# EAGLE design HFS_4011s_Rev_0 (EAGLE 8.3.2)
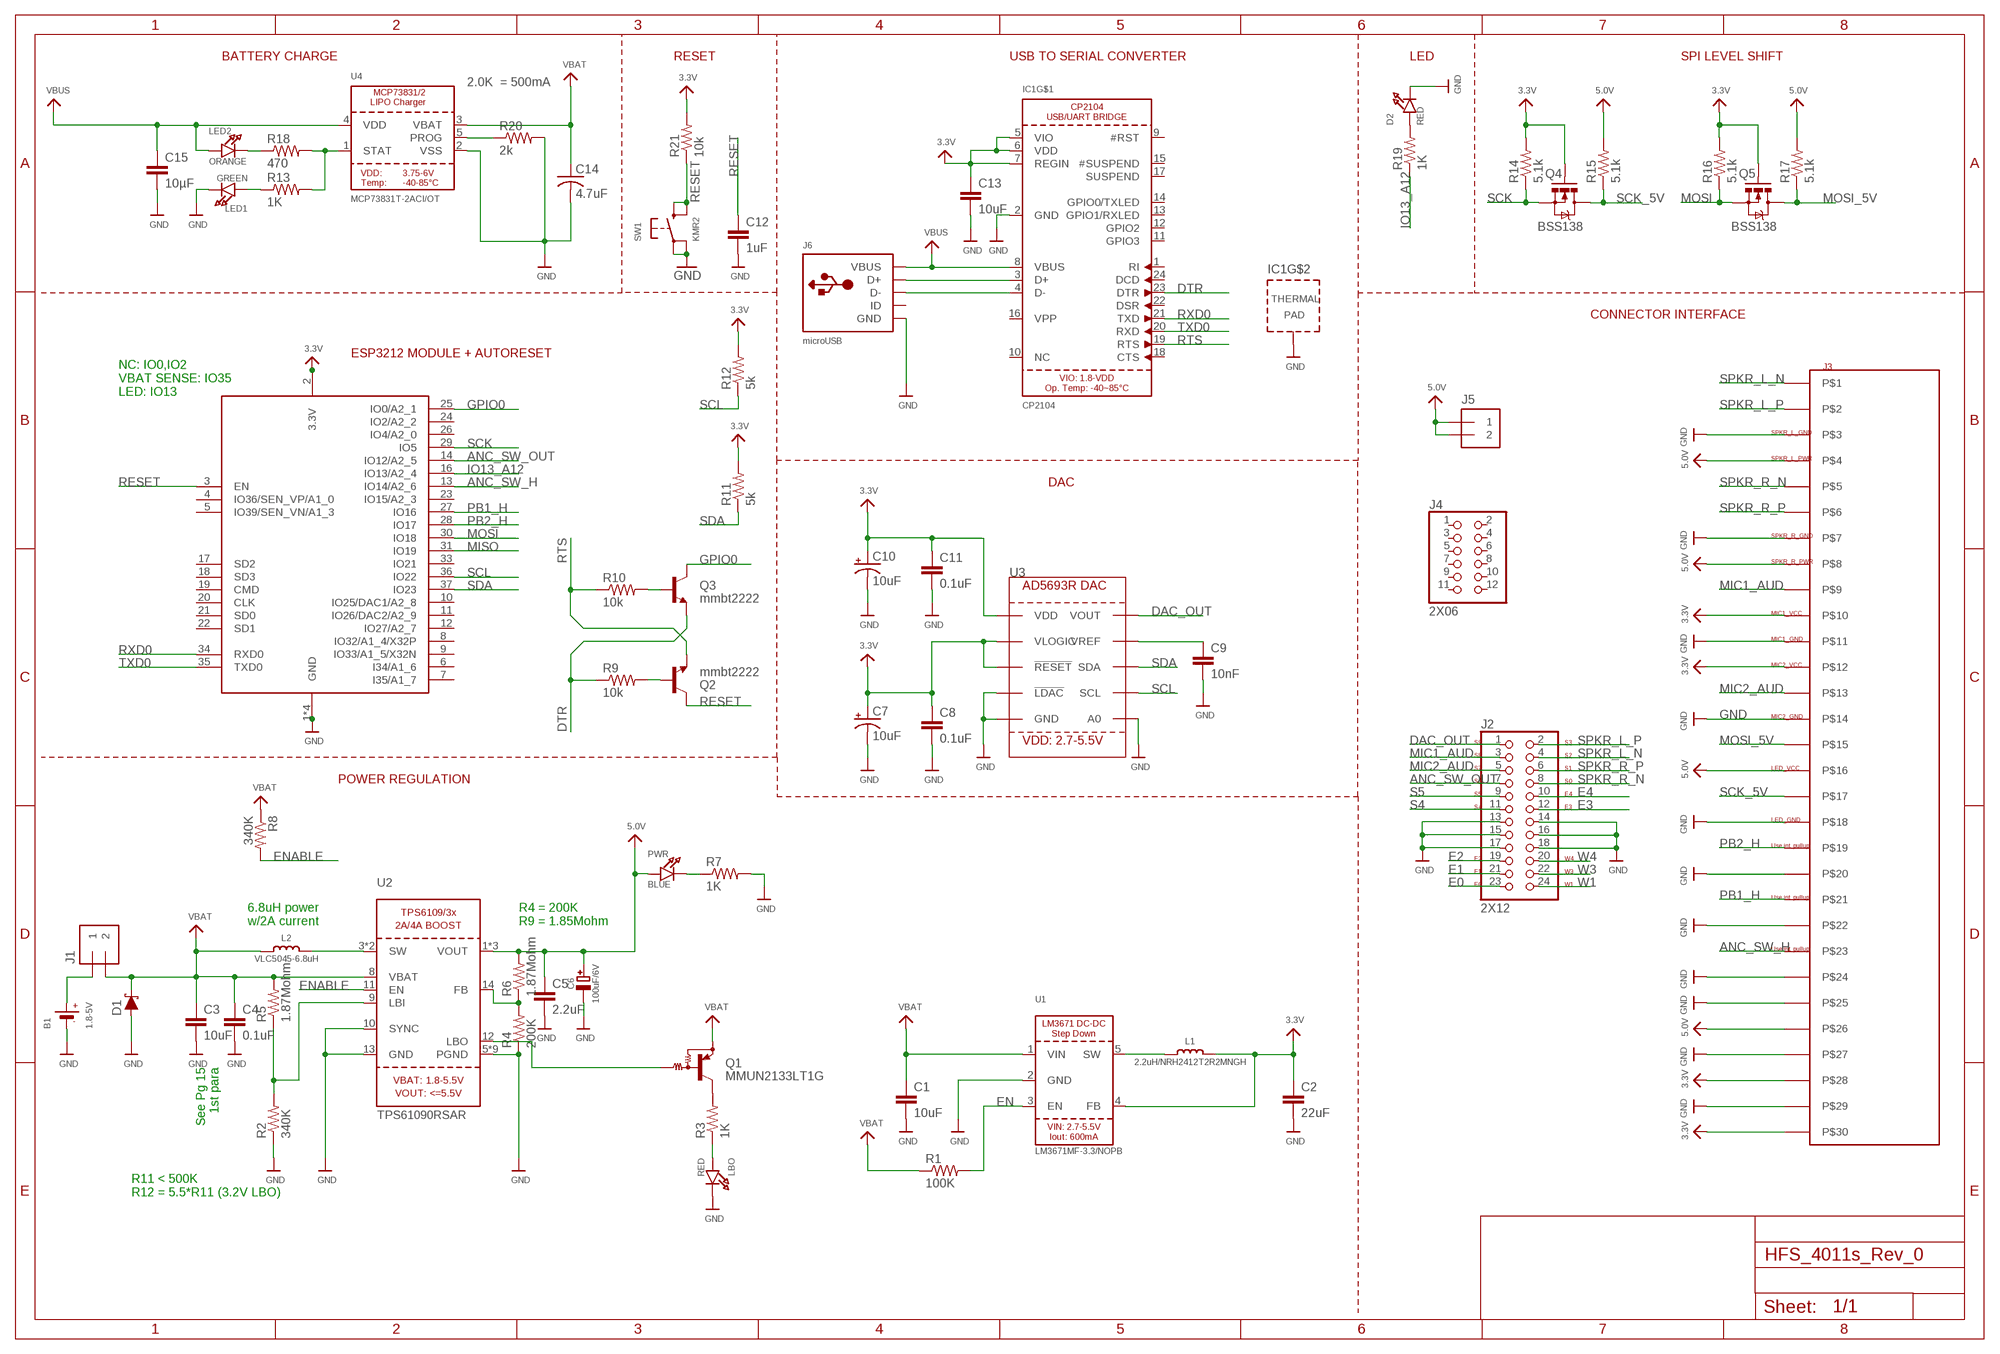
[diagram p0: schematic, sheet 1]

## Parts
B1  1.8-5V  BATTERY  [JSTPH2]
C1  10uF  C-EUC0603  [C0603]
C2  22uF  C-EUC0603  [C0603]
C3  10uF  C-EUC0603  [C0603]
C4  0.1uF  C-EUC0603  [C0603]
C5  2.2uF  C-EUC0603  [C0603]
C6  100uF/6V  CAP_TANTALUMB/3528_REFLOW  [EIA3528-21/B-R]
C7  10uF  10UF-TANT  [EIA3216]
C8  0.1uF  C-EUC0603  [C0603]
C9  10nF  C-EUC0603  [C0603]
C10  10uF  10UF-TANT  [EIA3216]
C11  0.1uF  C-EUC0603  [C0603]
C12  1uF  C-EUC0603  [C0603]
C13  10uF  C-EUC0603  [C0603]
C14  4.7uF  C-USC1206  [C1206]
C15  10µF  C-EUC0603  [C0603]
D1  SMAJ5.0CALFDKR-ND  [DO-214AC]
D2  RED  LED0805_NOOUTLINE  [CHIPLED_0805_NOOUTLINE]
IC1  CP2104  [QFN24_4MM_SMSC]
J1  1X02  [1X02]
J2  2X12  [2X12]
J3  MOLEX_IGRID_15X2CONNECTOR  [MOLEX_IGRID15X2CONNECTOR]
J4  2X06  [2X06]
J5  1X02  [1X02]
J6  microUSB  USBMICRO_20329  [4UCONN_20329]
L1  2.2uH/NRH2412T2R2MNGH  INDUCTORNRH2412T  [INDUCTOR_TAIYOYUDEN_NRH2412T]
L2  VLC5045-6.8uH  INDUCTORTDK_VLC5045  [INDUCTOR_5X5MM_TDK_VLC5045]
LBO  RED  LED0805_NOOUTLINE  [CHIPLED_0805_NOOUTLINE]
LED1  GREEN  LED0805_NOOUTLINE  [CHIPLED_0805_NOOUTLINE]
LED2  ORANGE  LED0805_NOOUTLINE  [CHIPLED_0805_NOOUTLINE]
PWR  BLUE  LED0805_NOOUTLINE  [CHIPLED_0805_NOOUTLINE]
Q1  MMUN2133LT1G  MUN2114T1-PNP_DRIVER-SC59-BEC  [SC59-BEC]
Q2  mmbt2222  TRANSISTOR_NPNSOT23-3  [SOT23-3]
Q3  mmbt2222  TRANSISTOR_NPNSOT23-3  [SOT23-3]
Q4  BSS138  MOSFET-NCHANNELSMD  [SOT23-3]
Q5  BSS138  MOSFET-NCHANNELSMD  [SOT23-3]
R1  100K  R-US_R0603  [R0603]
R2  340K  R-US_R0603  [R0603]
R3  1K  R-US_R0603  [R0603]
R4  200K  R-US_R0603  [R0603]
R5  1.87Mohm  R-US_R0603  [R0603]
R6  1.87Mohm  R-US_R0603  [R0603]
R7  1K  R-US_R0603  [R0603]
R8  340K  R-US_R0603  [R0603]
R9  10k  R-US_R0603  [R0603]
R10  10k  R-US_R0603  [R0603]
R11  5k  R-US_R0603  [R0603]
R12  5k  R-US_R0603  [R0603]
R13  1K  R-US_R0603  [R0603]
R14  5.1k  R-US_R0603  [R0603]
R15  5.1k  R-US_R0603  [R0603]
R16  5.1k  R-US_R0603  [R0603]
R17  5.1k  R-US_R0603  [R0603]
R18  470  R-US_R0603  [R0603]
R19  1K  R-US_R0603  [R0603]
R20  2k  R-US_R0603  [R0603]
R21  10k  R-US_R0603  [R0603]
SW1  KMR2  SWITCH_TACT_SMT4.6X2.8  [BTN_KMR2_4.6X2.8]
U1  LM3671MF-3.3/NOPB  VREG_LM3671  [SOT23-5]
U2  TPS61090RSAR  VREG_TPS6103X  [PVQFN-16]
U3  AD5693R  [MSOP10]
U4  MCP73831T-2ACI/OT  MCP73831/2  [SOT23-5]
X1  ESP32_WROOM32_SKINNY  [WROOM32_SKINNY]

## Nets
3.3V: C2.1 C7.A(+) C8.1 C10.A(+) C11.1 C13.1 IC1.5(VIO) IC1.6(VDD) IC1.7(REGIN) J3.P$10 J3.P$12 J3.P$28 J3.P$30 L1.2 Q4.1(G) Q5.1(G) R11.2 R12.2 R14.2 R16.2 R21.2 U1.4(FB) U3.1(VDD) U3.2(VLOGIC) U3.3(!RESET!) X1.2(3.3V)
5.0V: C5.1 C6.+ J3.P$4 J3.P$8 J3.P$16 J3.P$26 J5.1 J5.2 PWR.A R6.2 R15.2 R17.2 U2.1(VOUT) U2.15(VOUT) U2.16(VOUT)
ANC_SW_H: J3.P$23 X1.13(IO14/A2_6)
ANC_SW_OUT: J2.7 X1.14(IO12/A2_5)
DAC_OUT: J2.1 U3.10(VOUT)
DTR: IC1.23(DTR) Q3.2(E) R9.1
E0: J2.23
E1: J2.21
E2: J2.19
E3: J2.12
E4: J2.10
EN: R1.2 U1.3(EN)
ENABLE: R8.2 U2.11(EN)
GND: B1.1(-) C1.2 C2.2 C3.2 C4.2 C5.2 C6.- C7.C(-) C8.2 C9.2 C10.C(-) C11.2 C12.2 C13.2 C14.2 C15.2 D1.A D2.C IC1.2(GND) IC1.THERM(TP) J2.13 J2.14 J2.15 J2.16 J2.17 J2.18 J3.P$3 J3.P$7 J3.P$11 J3.P$14 J3.P$18 J3.P$20 J3.P$22 J3.P$24 J3.P$25 J3.P$27 J3.P$29 J6.BASE@1(GND) J6.BASE@2(GND) J6.GND J6.SPRT@1(GND) J6.SPRT@2(GND) J6.SPRT@3(GND) J6.SPRT@4(GND) LBO.C LED1.C R2.1 R4.1 R7.2 R20.2 SW1.A'(P1) SW1.A(P) U1.2(GND) U2.5(PGND) U2.6(PGND) U2.7(PGND) U2.10(SYNC) U2.13(GND) U2.P$18(PGND) U2.P$19(PGND) U2.P$20(PGND) U2.P$21(PGND) U2.P$22(PGND) U2.THERMAL(PGND) U3.4(!LDAC!) U3.5(GND) U3.6(A0) U4.2(VSS) X1.1(GND) X1.15(GND) X1.38(GND) X1.P$1(GND)
GPIO0: Q3.3(C) X1.25(IO0/A2_1)
IO13_A12: R19.1 X1.16(IO13/A2_4)
LBO: Q1.B U2.12(LBO)
MIC1_AUD: J2.3 J3.P$9
MIC2_AUD: J2.5 J3.P$13
MISO: X1.31(IO19)
MOSI: Q5.2(S) R16.1 X1.30(IO18)
MOSI_5V: J3.P$15 Q5.3(D) R17.1
N$1: LED2.C R18.1
N$2: IC1.3(D+) J6.D+
N$3: L2.P$2 U2.3(SW) U2.4(SW)
N$4: R2.2 R5.1 U2.9(LBI)
N$5: D2.A R19.2
N$6: IC1.4(D-) J6.D-
N$7: R13.2 R18.2 U4.1(STAT)
N$8: R20.1 U4.5(PROG)
N$9: LED1.A R13.1
N$10: PWR.C R7.1
N$11: R4.2 R6.1 U2.14(FB)
N$12: Q2.1(B) R9.2
N$13: Q3.1(B) R10.2
N$14: LBO.A R3.1
N$15: Q1.C R3.2
N$16 [power]: B1.2(+) J1.1
N$17: L1.1 U1.5(SW)
N$20: C9.1 U3.9(VREF)
PB1_H: J3.P$21 X1.27(IO16)
PB2_H: J3.P$19 X1.28(IO17)
RESET: C12.1 Q2.3(C) R21.1 SW1.B'(S1) SW1.B(S) X1.3(EN)
RTS: IC1.19(RTS) Q2.2(E) R10.1
RXD0: IC1.21(TXD) X1.34(RXD0)
S4: J2.11
S5: J2.9
SCK: Q4.2(S) R14.1 X1.29(IO5)
SCK_5V: J3.P$17 Q4.3(D) R15.1
SCL: R12.1 U3.7(SCL) X1.36(IO22)
SDA: R11.1 U3.8(SDA) X1.37(IO23)
SPKR_L_N: J2.4 J3.P$1
SPKR_L_P: J2.2 J3.P$2
SPKR_R_N: J2.8 J3.P$5
SPKR_R_P: J2.6 J3.P$6
TXD0: IC1.20(RXD) X1.35(TXD0)
VBAT: C1.1 C3.1 C4.1 C14.1 D1.C J1.2 L2.P$1 Q1.E R1.1 R5.2 R8.1 U1.1(VIN) U2.8(VBAT) U4.3(VBAT)
VBUS: C15.1 IC1.8(VBUS) J6.VBUS LED2.A U4.4(VDD)
W1: J2.24
W3: J2.22
W4: J2.20
Unconnected: IC1.1(RI) IC1.9(#RST) IC1.10(NC) IC1.11(GPIO3) IC1.12(GPIO2) IC1.13(GPIO1/RXLED) IC1.14(GPIO0/TXLED) IC1.15(#SUSPEND) IC1.16(VPP) IC1.17(SUSPEND) IC1.18(CTS) IC1.22(DSR) IC1.24(DCD) J4.1 J4.2 J4.3 J4.4 J4.5 J4.6 J4.7 J4.8 J4.9 J4.10 J4.11 J4.12 J6.ID X1.4(IO36/SEN_VP/A1_0) X1.5(IO39/SEN_VN/A1_3) X1.6(I34/A1_6) X1.7(I35/A1_7) X1.8(IO32/A1_4/X32P) X1.9(IO33/A1_5/X32N) X1.10(IO25/DAC1/A2_8) X1.11(IO26/DAC2/A2_9) X1.12(IO27/A2_7) X1.17(SD2) X1.18(SD3) X1.19(CMD) X1.20(CLK) X1.21(SD0) X1.22(SD1) X1.23(IO15/A2_3) X1.24(IO2/A2_2) X1.26(IO4/A2_0) X1.33(IO21)

## Notes on the sheet
- BATTERY CHARGE | RESET | USB TO SERIAL CONVERTER | LED | SPI LEVEL SHIFT
- 2.0K  = 500mA
- CONNECTOR INTERFACE
- ESP3212 MODULE + AUTORESET
- NC: IO0,IO2
  VBAT SENSE: IO35
  LED: IO13
- SPKR_L_GND
- SPKR_L_PWR
- DAC
- SPKR_R_GND
- SPKR_R_PWR
- MIC1_VCC
- MIC1_GND
- MIC2_VCC
- MIC2_GND
- S9 | S3
- S8 | S2
- S7 | S1 | LED_VCC
- POWER REGULATION | S6 | S0
- S5 | E4
- S4 | E3
- LED_GND
- Use int. pullup
- E2 | W4
- E1 | W3
- E0 | W1
- Use int. pullup
- 6.8uH power
  w/2A current
- R4 = 200K
  R9 = 1.85Mohm
- Use int. pullup
- See Pg 15
  1st para
- R11 < 500K
  R12 = 5.5*R11 (3.2V LBO)

## Library data of the parts
B1 = microbuilder:BATTERY: CR1220 SMT - Digikey: 3001K-ND CD2032 BAT-HLD-001 - Digikey: BAT-HLD-001-ND
C1-C5 C8 C9 C11-C13 C15 = rcl:C-EU: CAPACITOR, European symbol
C6 = microbuilder:CAP_TANTALUM: Tantalum Capacitors Wave footprints have larger pads and are meant to be used for hand soldering. Reflow footprints are optimised for solder paste and a reflow oven. EIA3216-18/A-[R/W] - Size A / 3216-18 / 1206 footprint 4.7µF 25V 10% Tantalum Capacitor 10µF 16V 10% Tantalum Capacitor [Digikey: 495-2236-2-ND] EIA3528-21/B-[R/W] - Size B / 3528-21 47µF 10V 10% Tantalum Capactior [Digikey: 495-2216-1-ND] EIA6032-28/C-[R/W] - Size C / 6032-28 10µF 35V 20% Tantalum Capacitor [Digikey: 495-2285-1-ND] 100µF 16V 10% Tantalum Capactior [Digikey: 399-5214-1-ND]
C7 C10 = SparkFun-Retired:10UF-TANT: 10uF Tantalum SMT CAP-00811- 16V 10% (EIA-3216); PROD_ID: CAP-00811
C14 = rcl:C-US: CAPACITOR, American symbol
D1 = HFS4011sCustom:SMAJ5.0CALFDKR-ND
D2 LBO LED1 LED2 PWR = microbuilder:LED: LED 0603 - 0603 Surface Mount Package 2mA: Green LED - Low Power (3.9mcd, 2ma, 1.7Vf) - Digikey: 475-2709-2-ND Orange LED - Low Power (9.8mcd, 2ma, 1.8Vf) - Digikey: 475-1194-2-ND Red LED - Low Power (5mcd, 2ma, 1.8Vf) - Digikey: 475-1195-2-ND Yellow LED - Low Power (7mcd, 2ma, 1.8Vf) - Digikey: 475-1196-2-ND 5mA: Blue LED - Low Power (17mcd, 5ma, 2.9Vf) - Digikey: LNJ937W8CRACT-ND 0805 - 0805 Surface Mount Package 2mA: Red LED (8.8mcd, 2mA, 1.8Vf, Clear) - Low Power [Digikey: 475-2510-1-ND] Green LED (5mcd, 2mA, 1.8Vf, Clear) - Low Power [Digikey: 475-2730-1-ND] Yellow LED (11.3mcd, 2mA, 1.8Vf, Clear) - Low Power [Digikey: 475-2555-1-ND] 20mA: Red LED (104mcd, 20mA, Diffused) - LS R976 [Digikey: 475-1278-6-ND] Red LED (12mcd, 20mA, 2.0Vf, Clear) - APT2012EC [Digikey: 754-1128-1-ND] Green LED (15mcd, 20mA, 2.2Vf, Clear) - APT2012GC [Digikey: 754-1131-1-ND] Orange LED (160mcd, 20mA, 2.1Vf, Clear) - APT2012SECK [Digikey: 754-1130-1-ND] 1206 - 1206 Surface Mount Package Green LED (26mcd, 20mA, Diffused) - LG N971 [Digikey: 475-1407-6-ND] Red LED (15mcd, 20mA, Diffused) - LH N974 [Digikey: 475-1416-6-ND] Cree - Cree High-Power Surface Mount LEDs XPEBWT-L1-0000-00D50 - White 111lm 350mA 2.9Vf 6200K 110° XTEAWT-00-0000-00000LEE3 - White 114lm 350mA 2.85Vf 5000K 115° Everlight - Everlight 45-21 Series Surface Mount LEDs 45-21/QK2C-B2832AC2CB2/2T - Warm White 2000mcd 20mA 3.25Vf 3050K 120° 45-21/LK2C-B38452C4CB2/2T - Nuetral White 2000mcd 20mA 3.25Vf 4150K 120° 45-21/LK2C-B50634C6CB2/2T - Cold White 2200mcd 20mA 3.25Vf 5650K 120° PLCC2 Reverse Mount LS T77K-J1L2-1-0-2-R18-Z - Red 11.25mcd 2mA 1.8Vf 630nm 120° LO T77K-L1M2-24-Z - Orange 19.6mcd 2mA 1.8Vf 606nm 120° LY T77K-K2M1-26-Z - Yellow 15.7mcd 2mA 1.8Vf 587nm 120°
IC1 = microbuilder:CP2104: CP2104 - USB to UART Bridge VDD Output: 3.45V
J1 J5 = HFS4011sCustom:1X02
J2 = HFS4011sCustom:2X12: 2x12 Pin header connector
J3 = HFS4011sCustom:MOLEX_IGRID_15X2CONNECTOR
J4 = HFS4011sCustom:2X06: 2x06 Pin Header connector
J6 = microbuilder:USB: USB Connectors USBMINIB - Surface Mount Female Mini-B USB Connector 4UConnector: 06564
L1 L2 = microbuilder:INDUCTOR: Inductors 0603: 10nH Ceramic Inductor - microwire antenna/RF (Digikey: 712-1434-2-ND) 0805: 560nH Ceramic Inductor - RF (Digikey: 553-1047-1-ND) 270nH Ceramic Inductor - Q = 40@250MHz, +-5%, 1 Ohm DC Resistance (Digikey: 535-10506-2-ND) 1007 (2518 Metric) SMT: 10µH 10% 250mOhm 820mA 1007 Inductor (Digikey: 587-2189-1-ND) 22µH 10% 500mOhm 580mA 1007 Inductor (Digikey: 587-2190-1-ND) 47µH 10% 950mOhm 420mA 1007 Inductor (Digikey: 587-2191-1-ND) 47µH 5% 100mOhm 1A 1008 Inductor (Digikey: 732-1816-1-ND) 5.0x5.0mm (Taiyo Yuden NR5040 Series) 6.8µH 20% 2.3A 64mOhm Inductor (Digikey: 587-2374-2-ND) 5.0x5.0mm (TDK VLC5045 Series) 4.7µH 20% 3.3A 34mOhm Inductor (Digikey: 445-6526-1-ND) 6.8µH 20% 2.7A 46mOhm Inductor (Digikey: 445-6527-1-ND) 6.0x6.0mm (TDK VLC6045 Series) 4.7µH 20% 3.8A 27mOhm Inductor (Digikey: 445-6538-2-ND) 6.8µH 20% 3A 41mOhm Inductor (Digikey: 445-6540-1-ND) 6.2µH 30% 2.2A 45mOhm Inductor (Digikey: SRR5028-6R2YCT-ND) - Not TDK VLC6045 but footprint should match 6.0x6.0mm (TDK SLF6045 Series) 6.8uH 30% 2A 33mOhm Inductor (Digikey: 445-4572-1-ND, Mouser: 810-SLF645T6R8N2R0PF) 6.0x6.0mm (Sumida CDRH5D28 Series) 6.2uH 30% 1.8A 45mOhm Inductor (Digikey: 308-1542-1-ND) Taiyo Yuden NR3015T2R2M - 2.2uH 20% 1.5A (Digikey: 587-1648-2-ND, Mouser: 963-NR3015T2R2M) - Used with TI TPS62172 CoilCraft RFID Transponder Coil - MA5532-AE (For use with AS3935 Lightning Sensor) Taiyo Yuden NRH2412T2R2MNGH - 2.2uH 20% 1AA (Digikey: 587-3443-1-ND) - Used with TI LM3671 Vishay IHLP 1.0uH Molded Inductor - 24mOhm DCR, 5A, +/-20%, -55°C-125°C (Digikey: 541-1319-1-ND)
Q1 = transistor:*-PNP_DRIVER-: PNP Bias Resistor Transistor
Q2 Q3 = SparkFun:TRANSISTOR_NPN: Transistor NPN BJT configuration in SOT23 package. MMBT2222 is the common NPN we use. Double check BCE configuration again layout.
Q4 Q5 = SparkFun:MOSFET-NCHANNEL
R1-R21 = rcl:R-US_: RESISTOR, American symbol
SW1 = microbuilder:SWITCH_TACT_SMT: SMT Tact Switches 6x6mm - Digikey: P12940SCT-ND KMR2 (4.6x2.8mm) - Digikey: 401-1426-1-ND EVQ-PQHB55 - Light Touch, 160GF (4.5x4.5mm) - Digikey: P8090SCT-ND KMT0 - KMT021 NGJ LHS (etc.) IP68/Waterproof - Digikey: CKN10289CT-ND
U1 = microbuilder:VREG_LM3671: LM3671 - 600mA DC-DC Step-Down Converter VIN: 2.7-5.5V Load Current: 600mA Switching Frequency: 2MHz Iq: 16uA
U2 = microbuilder:VREG_TPS6103X: TPS6103x 4A Boost - 1.8-5.5V Input, Adjustable Output to 5.5V
U3 = HFS4011sCustom:AD5693R
U4 = microbuilder:MCP73831/2: MCP73831/2 LIPO Charger VDD: 3.75 - 6V Temp -40 - 85°C Programmable Charge Rate: 15-500mA NOTE: STAT is a tri-state logic output on the MCP73831 and an open-drain output on the MCP73832. SOT23-5 with 4.2V output and tri-state logic on STAT = MCP73831T-2ACI/OT
X1 = microbuilder:ESP32_WROOM32

## Net classes
0 default: clearance 0.254 mm
1 power: width 0.178 mm, clearance 0.381 mm

## Board
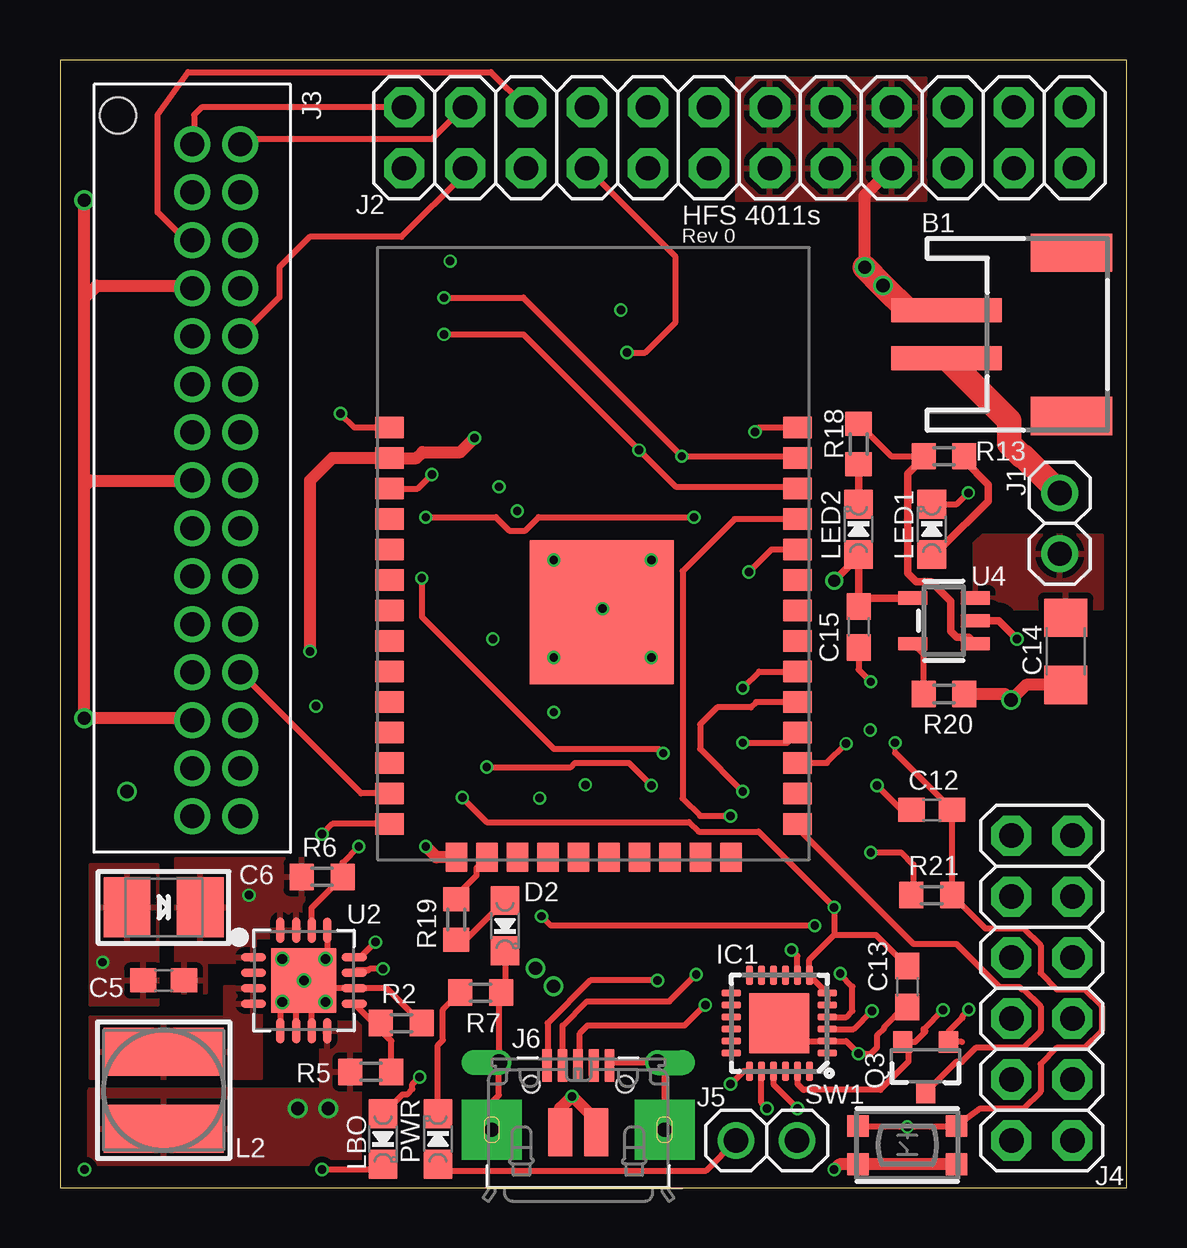
[diagram p1: board, top side]
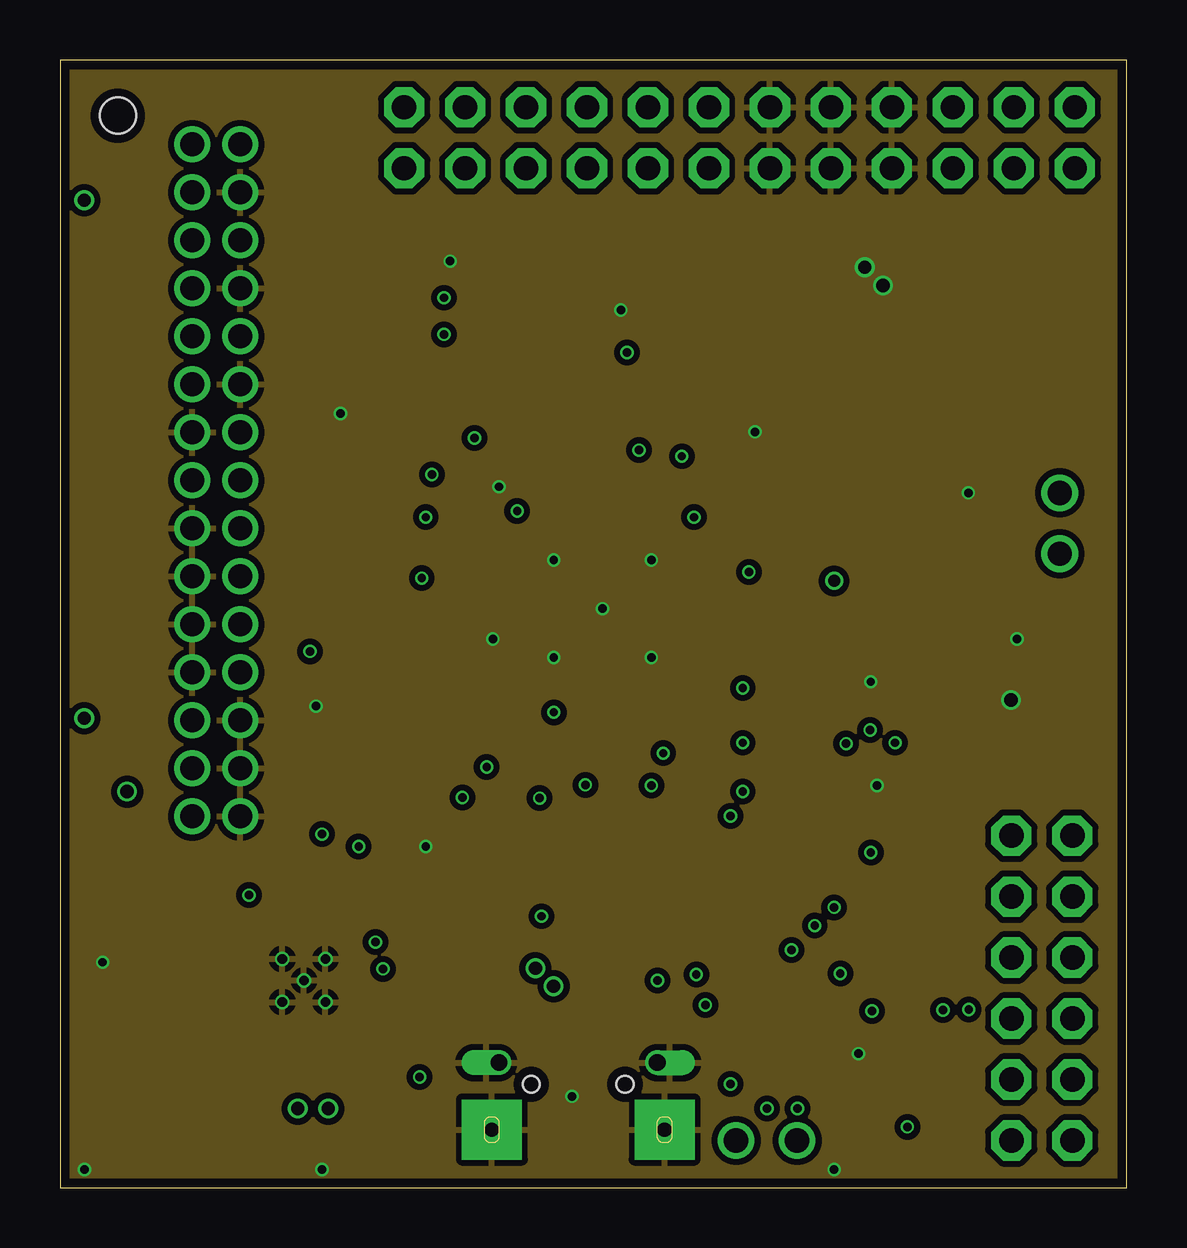
[diagram p2: board, inner layer Route2]
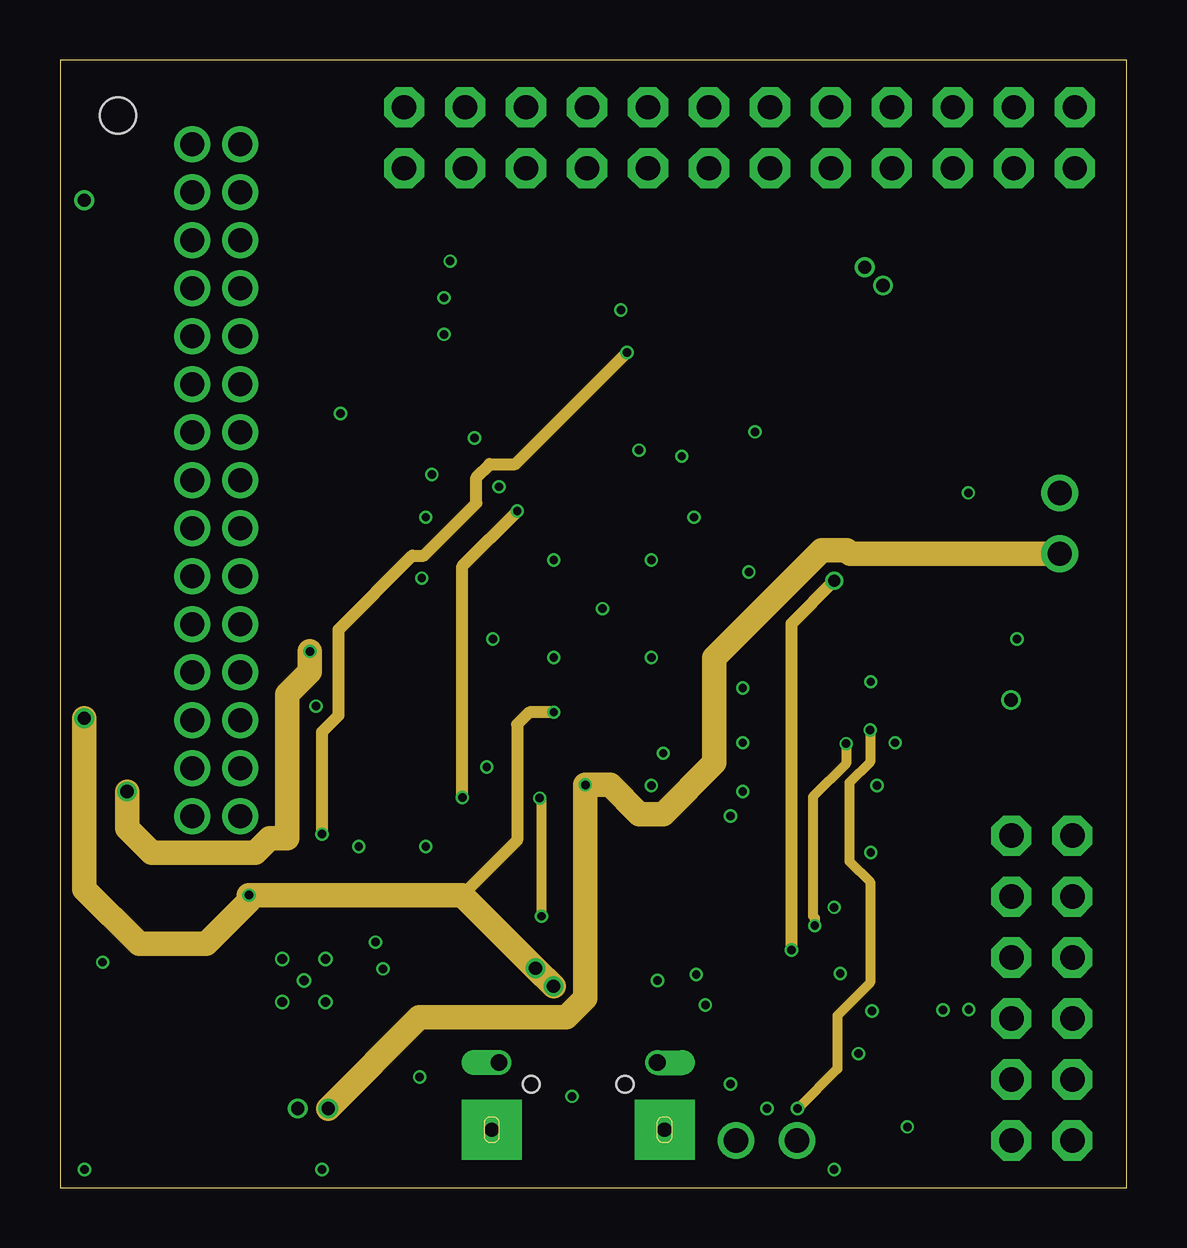
[diagram p3: board, inner layer Route3]
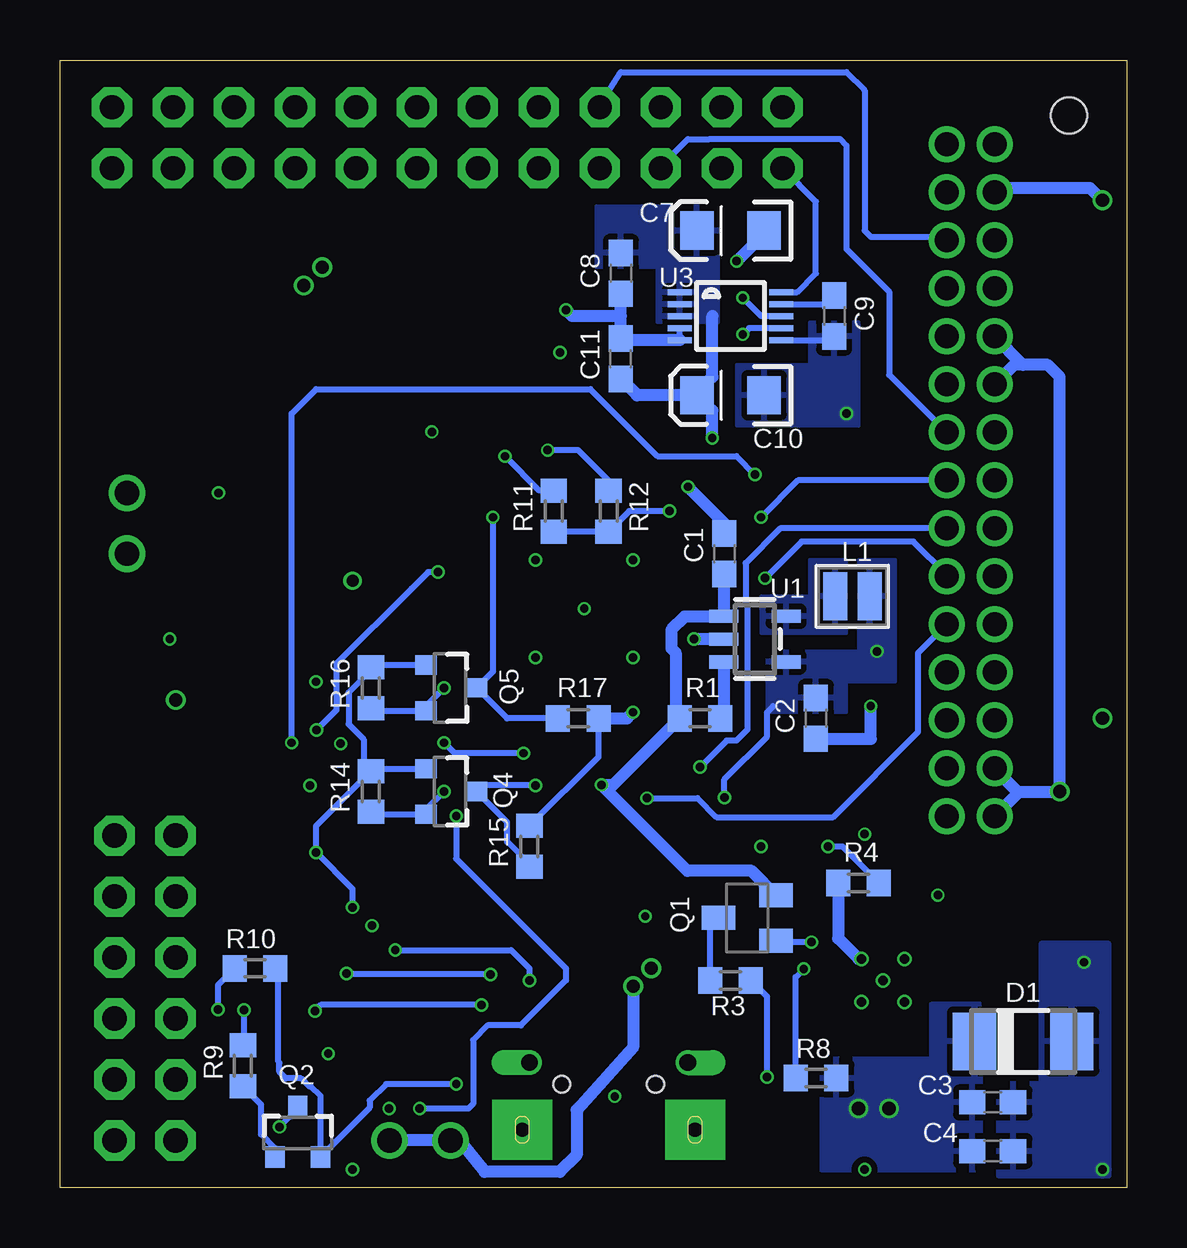
[diagram p4: board, bottom side, seen from below]

Size 44.45 x 46.99 mm. Coordinates in mm from the lower left corner, seen from the top.
Outline: 0,0 44.45,0 44.45,46.99 0,46.99 0,0
Copper layers (1*2+3*16): Top 0.035mm / dielectric 0.2mm / Route2 0.035mm / dielectric 0.15mm / Route3 0.035mm / dielectric 0.2mm / Bottom 0.035mm
Design rules "hfs4011s *": minimum track width 5mil, minimum drill 10mil, track to track 5mil, track to pad 5mil, pad to pad 5mil, via to via 5mil, smd to smd 0mil, copper to edge 15mil, drill to drill 6mil, minimum pad ring 4mil, minimum via ring 4mil, stop-mask expansion 2.5mil, vias tented up to drill 0mil, thermal gap 10mil

### Footprints (pad centres in the part's own frame; a part is rotated, then mirrored left to right if it is on the bottom)
JSTPH2 = smd 1 x 4.6: 1 -1,-3.7; 2 1,-3.7 | smd 1.6 x 3.4: NC1 -3.4,1.5; NC2 3.4,1.5
C0603 = smd 1.1 x 1: 1 -0.85,0; 2 0.85,0
EIA3528-21/B-R = smd 1.95 x 2.5: + 1.525,0; - -1.525,0
EIA3216 = smd 1.4 x 1.6: A 1.4,0; C -1.4,0
C1206 = smd 1.6 x 1.8: 1 -1.4,0; 2 1.4,0
DO-214AC = smd 1.8 x 2.4: A 2.025,0; C -2.025,0
CHIPLED_0805_NOOUTLINE = smd 1.2 x 1.2: A 0,-1.05; C 0,1.05
QFN24_4MM_SMSC = smd 0.8 x 0.28: 1 -2,1.25; 2 -2,0.75; 3 -2,0.25; 4 -2,-0.25; 5 -2,-0.75; 6 -2,-1.25; 13 2,-1.25; 14 2,-0.75; 15 2,-0.25; 16 2,0.25; 17 2,0.75; 18 2,1.25 | smd 0.28 x 0.8: 7 -1.25,-2; 8 -0.75,-2; 9 -0.25,-2; 10 0.25,-2; 11 0.75,-2; 12 1.25,-2; 19 1.25,2; 20 0.75,2; 21 0.25,2; 22 -0.25,2; 23 -0.75,2; 24 -1.25,2 | smd 2.5 x 2.5: THERM 0,0
1X02 = drill 1.016: 1 -1.27,0; 2 1.27,0
2X12 = drill 1.016 pad 1.676 octagon: 1 -13.97,-1.27; 2 -13.97,1.27; 3 -11.43,-1.27; 4 -11.43,1.27; 5 -8.89,-1.27; 6 -8.89,1.27; 7 -6.35,-1.27; 8 -6.35,1.27; 9 -3.81,-1.27; 10 -3.81,1.27; 11 -1.27,-1.27; 12 -1.27,1.27; 13 1.27,-1.27; 14 1.27,1.27; 15 3.81,-1.27; 16 3.81,1.27; 17 6.35,-1.27; 18 6.35,1.27; 19 8.89,-1.27; 20 8.89,1.27; 21 11.43,-1.27; 22 11.43,1.27; 23 13.97,-1.27; 24 13.97,1.27
MOLEX_IGRID15X2CONNECTOR = drill 1 pad 1.422: P$1 -12.99,1.16; P$2 -12.99,-0.84; P$3 -10.99,1.16; P$4 -10.99,-0.84; P$5 -8.99,1.16; P$6 -8.99,-0.84; P$7 -6.99,1.16; P$8 -6.99,-0.84; P$9 -4.99,1.16; P$10 -4.99,-0.84; P$11 -2.99,1.16; P$12 -2.99,-0.84; P$13 -0.99,1.16; P$14 -0.99,-0.84; P$15 1.01,1.16; P$16 1.01,-0.84; P$17 3.01,1.16; P$18 3.01,-0.84; P$19 5.01,1.16; P$20 5.01,-0.84; P$21 7.01,1.16; P$22 7.01,-0.84; P$23 9.01,1.16; P$24 9.01,-0.84; P$25 11.01,1.16; P$26 11.01,-0.84; P$27 13.01,1.16; P$28 13.01,-0.84; P$29 15.01,1.16; P$30 15.01,-0.84 | hole 1.5: -14.19,-3.94
2X06 = drill 1.016 pad 1.676 octagon: 1 -6.35,-1.27; 2 -6.35,1.27; 3 -3.81,-1.27; 4 -3.81,1.27; 5 -1.27,-1.27; 6 -1.27,1.27; 7 1.27,-1.27; 8 1.27,1.27; 9 3.81,-1.27; 10 3.81,1.27; 11 6.35,-1.27; 12 6.35,1.27
4UCONN_20329 = smd 1 x 2: BASE@1 -0.75,-2; BASE@2 0.75,-2 | smd 0.4 x 1.35: D+ 0,0.775; D- -0.65,0.775; GND 1.3,0.775; ID 0.65,0.775; VBUS -1.3,0.775 | drill 0.7 offset: SPRT@1 -3.3,0.9; SPRT@2 3.3,0.9 | drill 0.6 pad 2.5 square: SPRT@3 -3.6,-1.9; SPRT@4 3.6,-1.9 | hole 0.7: -1.95,0; 1.95,0
INDUCTOR_TAIYOYUDEN_NRH2412T = smd 1 x 2: 1 -0.725,0; 2 0.725,0
INDUCTOR_5X5MM_TDK_VLC5045 = smd 2 x 5: P$1 -1.6,0; P$2 1.6,0
SC59-BEC = smd 1 x 1.4: B -0.95,-1.2; C 0,1.2; E 0.95,-1.2
SOT23-3 = smd 0.8 x 0.9: 1 -0.95,-1; 2 0.95,-1; 3 0,1.1
R0603 = smd 1 x 1.1: 1 -0.85,0; 2 0.85,0
BTN_KMR2_4.6X2.8 = smd 0.9 x 0.9: A 2.05,0.8; A' -2.05,0.8; B 2.05,-0.8; B' -2.05,-0.8
SOT23-5 = smd 0.55 x 1.2: 1 -0.95,-1.3; 2 0,-1.3; 3 0.95,-1.3; 4 0.95,1.3; 5 -0.95,1.3
PVQFN-16 = smd 1.05 x 0.35: 1 -2.1,0.975; 2 -2.1,0.325; 3 -2.1,-0.325; 4 -2.1,-0.975; 9 2.1,-0.975; 10 2.1,-0.325; 11 2.1,0.325; 12 2.1,0.975 | smd 0.35 x 1.05: 5 -0.975,-2.1; 6 -0.325,-2.1; 7 0.325,-2.1; 8 0.975,-2.1; 13 0.975,2.1; 14 0.325,2.1; 15 -0.325,2.1; 16 -0.975,2.1 | drill 0.4: P$18 0,0; P$19 -0.9,0.9; P$20 0.9,0.9; P$21 0.9,-0.9; P$22 -0.9,-0.9 | smd 2.7 x 2.7: THERMAL 0,0
MSOP10 = smd 0.25 x 1: 1 -1,-2.113; 2 -0.5,-2.113; 3 0,-2.113; 4 0.5,-2.113; 5 1,-2.113; 6 1,2.113; 7 0.5,2.113; 8 0,2.113; 9 -0.5,2.113; 10 -1,2.113
WROOM32_SKINNY = smd 1.2 x 0.9: 1 -8.5,5; 2 -8.5,3.73; 3 -8.5,2.46; 4 -8.5,1.19; 5 -8.5,-0.08; 6 -8.5,-1.35; 7 -8.5,-2.62; 8 -8.5,-3.89; 9 -8.5,-5.16; 10 -8.5,-6.43; 11 -8.5,-7.7; 12 -8.5,-8.97; 13 -8.5,-10.24; 14 -8.5,-11.51; 25 8.5,-11.51; 26 8.5,-10.24; 27 8.5,-8.97; 28 8.5,-7.7; 29 8.5,-6.43; 30 8.5,-5.16; 31 8.5,-3.89; 32 8.5,-2.62; 33 8.5,-1.35; 34 8.5,-0.08; 35 8.5,1.19; 36 8.5,2.46; 37 8.5,3.73; 38 8.5,5 | smd 0.9 x 1.2: 15 -5.7,-12.9; 16 -4.43,-12.9; 17 -3.16,-12.9; 18 -1.89,-12.9; 19 -0.62,-12.9; 20 0.65,-12.9; 21 1.92,-12.9; 22 3.19,-12.9; 23 4.46,-12.9; 24 5.73,-12.9 | smd 6 x 6: P$1 0.34,-2.7

### Placement (x,y rotation side)
B1  40.64,35.56 270 top
C1  16.76,26.42 90 bottom
C2  12.95,19.56 270 bottom
C3  5.59,3.56 0 bottom
C4  5.59,1.52 0 bottom
C5  4.32,8.64 180 top
C6  4.32,11.68 0 top
C7  16.51,39.88 180 bottom
C8  21.08,38.1 270 bottom
C9  12.19,36.32 270 bottom
C10  16.51,33.02 180 bottom
C11  21.08,34.54 90 bottom
C12  36.32,15.75 180 top
C13  35.31,8.38 270 top
C14  41.91,22.35 270 top
C15  33.27,23.37 270 top
D1  4.32,6.1 0 bottom
D2  18.54,10.92 180 top
IC1  29.97,6.86 180 top
J1  41.66,27.69 270 top
J2  28.31,43.75 0 top
J3  6.35,30.48 270 top
J4  40.91,8.32 90 top
J5  29.44,1.97 180 top
J6  21.59,4.32 0 top
L1  11.43,24.64 0 bottom
L2  4.32,4.06 90 top
LBO  13.46,2.03 180 top
LED1  36.32,27.43 0 top
LED2  33.27,27.43 0 top
PWR  15.75,2.03 0 top
Q1  15.82,11.24 90 bottom
Q2  34.54,2.29 0 bottom
Q3  36.07,5.08 180 top
Q4  28.19,16.51 270 bottom
Q5  28.19,20.83 270 bottom
R1  17.78,19.56 0 bottom
R2  14.22,6.86 180 top
R3  16.51,8.64 180 bottom
R4  11.18,12.7 0 bottom
R5  12.95,4.83 180 top
R6  10.92,12.95 180 top
R7  17.53,8.13 0 top
R8  12.95,4.57 180 bottom
R9  36.83,5.08 270 bottom
R10  36.32,9.14 180 bottom
R11  23.88,28.19 270 bottom
R12  21.59,28.19 270 bottom
R13  36.83,30.48 180 top
R14  31.5,16.51 90 bottom
R15  24.89,14.22 90 bottom
R16  31.5,20.83 90 bottom
R17  22.86,19.56 0 bottom
R18  33.27,30.99 90 top
R19  16.51,11.18 270 top
R20  36.83,20.57 0 top
R21  36.32,12.19 180 top
SW1  35.31,1.78 180 top
U1  15.49,22.86 270 bottom
U2  10.16,8.64 0 top
U3  16.51,36.32 270 bottom
U4  36.83,23.62 90 top
X1  22.23,26.67 0 top

### Tracks (layer width: path | path; a pad name or v marks a point on that pad's centre or on a via)
3.3V  (via drill 0.35, 0.55)
  Top 0.254: 34.96,9.23 C13.1 34,10.54 32.26,10.54 | R21.2 35.47,12.53 35.56,12.62 35.56,13.46 35.05,13.97 v33.78,13.97 | 32.26,10.54 v32.26,11.68 29.11,14.84 26.61,14.84 26.21,15.24 17.78,15.24 v16.76,16.26 | IC1.6 IC1.5 | IC1.6 31.24,8.84 | IC1.6 IC1.7 31.22,9.5 32.26,10.54
  Top 0.508: 13.13,30.4 X1.2 | X1.2 11.35,30.4 10.41,29.46 v10.41,22.35 | X1.2 14.85,30.4 15.11,30.66 16.68,30.66 v17.27,31.24
  Route3 0.508: v16.76,16.26 16.76,25.91 v19.05,28.19
  Route3 1.016: v10.41,22.35 10.41,21.5 9.48,20.56 9.48,14.56 8.74,14.56 8.14,13.95 3.83,13.95 2.79,14.99 v2.79,16.51
  Bottom 0.254: v16.76,16.26 16.76,17.02 14.99,18.8 14.99,19.81 14.73,20.07 | v32.26,11.68 32.26,12.45 v33.78,13.97 33.78,15.07 31.79,17.06 | v19.05,28.19 20.74,28.19 R12.2 R11.2 | Q5.1 31.4,21.78 R16.2 31.5,21.57 32.43,20.64 32.43,19.32 31.79,18.69 31.79,17.06 | Q4.1 31.4,17.46 R14.2 31.79,17.06
  Bottom 0.508: 17.27,36.32 17.27,33.78 17.91,33.14 C10.A | 4.33,34.29 3.3,34.29 2.79,33.78 v2.79,16.51 4.55,16.51 | 4.33,34.29 J3.P$10 | 4.33,34.29 4.69,34.29 J3.P$12 | 4.55,16.51 J3.P$28 | 4.55,16.51 4.55,16.43 J3.P$30 | v17.27,31.24 17.27,32.38 C10.A | C10.A 20.41,33.02 C11.1
  pour Bottom: 9.65,26.16 11.18,26.16 11.18,22.35 14.99,22.35 14.99,19.81 11.68,19.81 11.68,21.08 9.65,21.08
  pour Bottom: 17.02,40.89 22.1,40.89 22.1,38.35 19.56,38.35 19.56,36.07 17.02,36.07
5.0V  (via drill 0.35, 0.55)
  Top 0.254: 9.84,12.72 R6.2 | PWR.A 15.76,0.71 26.92,0.71 J5.2
  Top 0.508: J3.P$26 5.42,19.56 v1.02,19.56 1.02,29.21 | 1.02,29.21 1.27,29.46 J3.P$16 | 1.02,29.21 1.02,37.08 | 1.02,37.08 1.52,37.59 5.39,37.59 J3.P$8 | 1.02,37.08 v1.02,41.15
  Route3 0.508: v20.57,19.81 19.56,19.81 19.05,19.3 19.05,14.48 16.76,12.19
  Route3 1.016: v20.57,8.39 v19.81,9.14 16.76,12.19 v7.87,12.19 7.87,11.94 6.1,10.16 3.3,10.16 1.02,12.45 v1.02,19.56
  Bottom 0.254: R17.2 22.01,17.96 R15.2
  Bottom 0.508: v20.57,8.39 20.57,5.85 22.92,3.24 22.92,1.36 23.62,0.66 26.76,0.66 27.81,1.97 J5.2 J5.1 | R17.2 20.83,19.56 v20.57,19.81 | v1.02,41.15 1.52,41.66 5.32,41.66 J3.P$4
  pour Top: 4.83,13.72 10.16,13.72 10.16,10.41 8.13,10.41 8.13,9.4 6.1,9.4 6.1,8.13 4.83,8.13
ANC_SW_H
  Top 0.254: X1.13 12.55,16.43 J3.P$23
ANC_SW_OUT  (via drill 0.35)
  Top 0.254: X1.14 11.35,15.16 v10.92,14.73 | v23.62,34.8 24.38,34.8 25.65,36.07 25.65,38.79 J2.7
  Route3 0.508: v10.92,14.73 10.92,19 11.61,19.68 11.61,23.26 14.69,26.34 15.16,26.34 17.35,28.53 17.35,29.6 17.9,30.15 18.97,30.15 v23.62,34.8
DAC_OUT
  Bottom 0.254: U3.10 13.73,37.32 12.95,38.1 12.95,41.09 J2.1
DTR  (via drill 0.35)
  Top 0.254: 30.99,4.06 31,4.08 34.18,4.08 35.35,5.25 35.35,5.81 Q3.2 35.63,6.08 35.98,6.44 | 30.99,4.06 30.99,4.08 | IC1.23 30.72,4.33 30.99,4.06 | 35.98,6.44 36.07,6.52 | 35.98,6.44 35.98,6.61 v36.79,7.41
  Bottom 0.254: v36.79,7.41 36.79,5.97 R9.1
EN
  Bottom 0.508: U1.3 16.79,19.69 R1.2
ENABLE  (via drill 0.35)
  Top 0.254: v13.46,9.12 12.91,9.12 12.84,9.05 12.35,9.05 U2.11
  Bottom 0.254: R8.2 13.8,8.78 v13.46,9.12
GND  (via drill 0.35, 0.55)
  Top 0.152: C12.2 35.05,15.75
  Top 0.254: IC1.THERM 30.72,6.11 IC1.2 32.75,6.11 v33.27,5.59 33.78,5.59 34.04,5.84 34.04,6.35 34.34,6.65 34.34,6.69 35.18,7.53 C13.2 | C15.2 33.27,21.59 v33.78,21.08 | 9.19,7.66 U2.5 | U2.13 11.13,9.61 U2.P$20 | R2.1 13.62,8.31 U2.10 10.48,8.31 | X1.38 29.13,31.67 v28.96,31.5 | D2.C 18.54,8.29 R7.2 18.29,8.04 J6.SPRT@1 18.29,3.86 17.99,3.56 J6.SPRT@3 | 35.05,15.75 v34.04,16.76 | LED1.C 37.37,28.48 v37.85,28.96 | X1.1 12.27,31.67 v11.68,32.26 | U2.7 10.48,8.31 | 10.48,8.31 U2.P$18 | U2.P$18 U2.P$22 U2.P$21 U2.P$18 | U2.6 9.84,8.31 U2.P$18 | J6.SPRT@4 25.19,4.92 J6.SPRT@2 23.02,5.22 J6.GND | v10.92,0.76 13.24,0.76 LBO.C
  Top 0.305: U4.2 39.12,23.62 v39.88,22.86
  Top 0.508: 20.84,2.02 J6.BASE@1 20.84,3.31 v21.34,3.81 22.34,2.81 J6.BASE@2 22.34,2.02 | SW1.A' SW1.A 32.47,0.98 v32.26,0.76 | C14.2 40.26,20.95 v39.62,20.32 39.37,20.57 R20.2 | v33.53,38.35 33.53,41.35 J2.17 | X1.15 15.69,13.77 v15.24,14.22 | 9.19,7.66 U2.P$22 U2.P$19 | U2.P$18 U2.P$20 | X1.P$1 22.57,24.09 v22.61,24.13
  Top 1.016: B1.1 35.32,36.56 v34.29,37.59 v33.53,38.35
  Bottom 0.254: U3.5 U3.4 | U3.6 12.34,35.32
  Bottom 0.508: U2.P$20 11.18,9.54 12.03,10.39 R4.1 | C2.2 10.67,18.71 v10.67,20.07 | U1.2 v18.03,22.86 | C1.2 16.76,27.69 v18.29,29.21 | C7.C 15.11,39.75 v16.26,38.61 | U3.5 21.01,35.32 C11.2 21.08,36.32 | 21.08,36.32 C8.2 | 21.08,36.32 23.11,36.32 v23.37,36.58 | 12.34,35.32 C9.2
  other vias: 20.57,26.16 24.64,26.16 20.57,22.1 24.64,22.1 1.78,9.4 1.02,0.76
  pour Route2 (isolate 0.152): -2.03,50.8 48.26,50.8 48.26,-2.54 -2.03,-2.54
  pour Top: 1.27,13.46 4.06,13.46 4.06,7.62 1.27,7.62
  pour Bottom: 0.76,10.16 3.56,10.16 3.56,4.32 5.33,4.32 5.33,0.51 0.76,0.51
  pour Bottom: 16.26,31.75 11.18,31.75 11.18,36.07 13.21,36.07 13.21,34.29 16.26,34.29
  pour Top: 28.19,46.23 36.07,46.23 36.07,41.15 28.19,41.15
GPIO0
  Top 0.254: 40.05,8.3 39.97,8.37 39.13,8.37 37.34,10.16 35.56,10.16 30.73,14.99 X1.25 | 40.05,8.3 40.07,8.27 | Q3.3 37.34,5.25 37.58,5.25 38.16,5.83 40.15,5.83 40.86,6.54 40.86,7.55 40.15,8.27 40.07,8.27 | 40.05,8.3 40.07,8.27
IO13_A12
  Top 0.254: X1.16 17.36,13.33 17.36,13.01 16.51,12.17 R19.1
LBO  (via drill 0.35)
  Top 0.254: U2.12 12.52,9.61 v13.14,10.23
  Bottom 0.254: v13.14,10.23 14.53,10.23 Q1.B
MIC1_AUD
  Top 0.254: J2.3 16.88,42.28 14.22,39.62 10.41,39.62 9.14,38.35 9.14,37.1 J3.P$9
MIC2_AUD
  Bottom 0.254: J2.5 19.42,42.56 18.29,43.69 17.4,43.69 17.39,43.7 11.95,43.7 11.68,43.43 11.68,39.12 9.91,37.34 9.91,33.87 J3.P$13
MOSI  (via drill 0.35)
  Top 0.254: X1.30 29.13,21.51 v28.45,20.83
  Bottom 0.254: R16.1 31.4,19.88 Q5.2 29.19,20.08 v28.45,20.83
MOSI_5V  (via drill 0.35)
  Top 0.254: v15.24,27.94 18.16,27.94 18.71,27.38 19.39,27.38 19.94,27.94 v26.42,27.94
  Bottom 0.254: R17.1 25.82,19.56 Q5.3 26.42,21.51 v26.42,27.94 | J3.P$15 13.71,29.47 v15.24,27.94
N$1
  Top 0.305: LED2.C R18.1
N$2  (via drill 0.35)
  Top 0.254: v26.89,7.62 26.03,6.76 21.99,6.76 21.66,6.43 21.66,5.67 J6.D+ | IC1.3 33.07,6.61 v33.83,7.37
  Bottom 0.254: v26.89,7.62 33.58,7.62 v33.83,7.37
N$3
  pour Top: 1.27,4.57 8.38,4.57 8.38,8.38 6.86,8.38 6.86,7.11 1.27,7.11
N$4
  Top 0.152: R2.2 13.37,6.55 13.64,6.28
  Top 0.254: R5.1 13.8,6.12 13.64,6.28 U2.9
N$5
  Top 0.254: R19.2 16.9,10.33 D2.A
N$6  (via drill 0.35)
  Top 0.254: J6.D- 20.94,6.76 21.95,7.77 25.39,7.77 v26.51,8.89 | v32.51,8.93 32.51,8.89 33.02,8.38 33.02,7.37 32.76,7.11 IC1.4
  Bottom 0.254: v26.51,8.89 32.47,8.89 v32.51,8.93
N$7
  Top 0.254: R13.2 34.63,30.48 R18.2
  Top 0.305: U4.1 37.86,22.94 37.36,22.94 37.12,23.18 37.12,24.43 36.3,25.25 35.68,25.25 35.32,25.61 35.32,29.76 35.88,30.32 R13.2
N$8
  Top 0.254: R20.1 35.98,22.22 U4.5
N$9
  Top 0.305: LED1.A 36.62,26.68 36.75,26.68 38.68,28.61 38.68,29.3 37.68,30.3 R13.1
N$10
  Top 0.254: PWR.C 15.75,5.94 15.96,6.15 15.96,7.41 R7.1
N$11  (via drill 0.35)
  Top 0.254: U2.14 10.48,11.67 R6.1 11.77,13.55 v12.45,14.22
  Bottom 0.254: v12.45,14.22 11.85,14.22 R4.2
N$12
  Bottom 0.152: Q2.1 35.49,1.65
  Bottom 0.254: R9.2 36.06,3.46 36.06,2.23 35.49,1.65
N$13  (via drill 0.35)
  Top 0.254: 37.58,6.08 Q3.1 37.02,6.5 37.6,7.07 37.6,7.16 v37.87,7.42
  Bottom 0.254: v37.87,7.42 37.87,8.45 R10.2
N$14  (via drill 0.35)
  Top 0.254: v14.99,4.62 14.69,4.32 14.69,4.12 14.46,3.9 14.28,3.9 LBO.A
  Bottom 0.254: v14.99,4.62 14.99,7.96 R3.1
N$15
  Bottom 0.254: R3.2 17.36,10.9 Q1.C
N$16
  Top 1.016: B1.2 39.55,31.95 39.55,30.99 40.07,30.47 40.14,30.47 J1.1
N$17
  pour Bottom: 11.68,26.16 13.21,26.16 13.21,24.64 15.24,24.64 15.24,23.11 11.68,23.11
N$20
  Bottom 0.254: U3.9 12.54,36.82 C9.1
PB1_H  (via drill 0.35)
  Top 0.254: X1.27 31.95,17.7 v32.76,18.5 | v31.45,10.92 20.46,10.92 v20.07,11.31
  Route3 0.406: v32.76,18.5 32.76,17.67 31.37,16.29 31.37,11.32 31.45,11.24 v31.45,10.92 | v20.07,11.31 20.07,16.15 v19.99,16.23
  Bottom 0.254: v19.99,16.23 17.89,16.23 17.1,15.45 12.24,15.45 8.7,18.99 8.7,22.28 J3.P$21
PB2_H  (via drill 0.35)
  Top 0.254: v15.07,25.4 15.07,23.79 20.57,18.29 24.95,18.29 v25.14,18.11 | v28.45,18.54 30.3,18.54 X1.28
  Bottom 0.254: J3.P$19 7.51,25.54 8.89,26.92 13.55,26.92 v15.07,25.4 | v28.45,18.54 28.01,18.11 v25.14,18.11
RESET  (via drill 0.35)
  Top 0.152: SW1.B' 37.14,2.54 | SW1.B 33.47,2.54
  Top 0.203: 34.8,18.12 v34.8,18.54
  Top 0.254: 37.14,2.54 v35.31,2.54 33.47,2.54 | SW1.B' 38.32,3.29 40.15,3.29 40.86,4 40.86,5.15 41.54,5.83 42.69,5.83 43.4,6.54 43.4,7.55 42.69,8.27 41.54,8.27 40.86,8.95 40.86,10.1 40.15,10.81 38.55,10.81 R21.1 C12.1 | 37.17,16 C12.1 | C12.1 34.8,18.12 | X1.3 14.91,29.13 v15.49,29.72
  Bottom 0.152: 34.54,3.3 Q2.3
  Bottom 0.254: 34.54,3.3 v35.31,2.54 | v34.8,18.54 34.8,32.26 33.78,33.27 22.35,33.27 19.56,30.48 16.26,30.48 v15.49,29.72
RTS  (via drill 0.35)
  Top 0.254: IC1.19 28.48,4.86 v27.94,4.32
  Bottom 0.152: 33.81,1.51 Q2.2
  Bottom 0.254: R10.1 35.35,9.03 35.35,5.25 35.31,5.2 35.31,4.83 35.04,4.56 34.4,4.56 34.06,4.22 33.99,4.22 33.59,3.83 Q2.2 31.54,3.34 31.54,3.64 30.86,4.32 v27.94,4.32
RXD0  (via drill 0.35)
  Top 0.254: IC1.21 29.72,4.31 v30.73,3.3 | X1.34 29.64,26.59 v28.7,25.65
  Route3 0.406: v33.76,19.07 33.76,17.74 32.9,16.88 32.9,13.6 33.76,12.74 33.76,8.55 32.39,7.18 32.39,4.96 v30.73,3.3
  Bottom 0.254: v33.76,19.07 32.94,19.9 32.94,21.83 29.79,24.97 | 29.79,24.97 29.62,25.15 | v28.7,25.65 29.11,25.65 29.79,24.97
SCK  (via drill 0.35)
  Top 0.254: X1.29 29.01,20.24 28.78,20.02 27.38,20.02 26.67,19.3 26.67,18.29 v28.45,16.51
  Bottom 0.254: R14.1 31.4,15.56 Q4.2 29.19,15.76 v28.45,16.51
SCK_5V  (via drill 0.35)
  Top 0.254: v17.78,17.53 21.28,17.53 21.46,17.7 23.7,17.7 v24.64,16.76
  Bottom 0.254: R15.1 24.89,13.48 25.82,14.42 25.82,15.24 Q4.3 26.84,16.76 v24.64,16.76 | J3.P$17 14.44,27.47 15.88,26.03 15.88,24.31 15.81,24.24 15.81,19.09 16.27,18.63 16.68,18.63 v17.78,17.53
SCL  (via drill 0.35)
  Top 0.254: v16,35.56 19.3,35.56 v24.13,30.73 25.65,29.21 30.64,29.21 X1.36
  Bottom 0.254: U3.7 15.74,35.82 v16,35.56 | R12.1 21.59,29.46 22.86,30.73 v24.13,30.73
SDA  (via drill 0.35)
  Top 0.254: v16,37.08 19.3,37.08 v25.91,30.48 30.64,30.48 X1.37
  Bottom 0.254: U3.8 15.24,36.32 v16,37.08 | R11.1 24.47,29.04 v25.91,30.48
SPKR_L_N
  Top 0.203: J2.4 16.83,45.02
  Top 0.254: 16.83,45.02 15.49,43.69 7.73,43.69 J3.P$1
SPKR_L_P
  Top 0.254: J2.2 5.9,45.02 5.59,44.7 5.59,43.55 J3.P$2
SPKR_R_N
  Bottom 0.254: J2.8 21.96,45.1 21.08,46.48 11.68,46.48 10.92,45.72 10.92,39.88 10.67,39.62 7.66,39.62 J3.P$5
SPKR_R_P
  Top 0.254: J3.P$6 5.23,39.47 4.06,40.64 4.06,44.7 5.33,46.48 17.96,46.48 J2.6
TXD0  (via drill 0.35)
  Top 0.254: X1.35 28.11,27.86 25.95,25.69 25.95,16.22 26.67,15.49 v27.94,15.49 | IC1.20 29.22,3.54 v29.46,3.3
  Bottom 0.254: v27.94,15.49 27.94,13.72 23.37,9.14 23.37,8.64 25.24,6.76 26.63,6.76 27.23,6.16 27.23,3.5 27.43,3.3 v29.46,3.3
VBAT  (via drill 0.35, 0.55)
  Route3 1.016: J1.2 32.93,26.42 32.78,26.56 31.73,26.56 27.26,22.08 27.26,17.7 25.13,15.57 24.14,15.57 22.93,16.79 v21.89,16.79 21.89,7.89 21.1,7.1 14.97,7.1 v11.18,3.3
  Bottom 0.254: 14.62,12.56 Q1.E
  Bottom 0.508: C1.1 16.79,25.52 U1.1 16.81,23.8 18.42,23.8 18.97,23.25 18.97,22.47 18.8,22.3 18.8,19.72 R1.1 21.4,16.79 v21.89,16.79 18.31,13.21 15.63,13.21 Q1.E
  other vias: 9.91,3.3
  pour Top (isolate 0.61): 38.1,24.64 38.61,24.13 43.43,24.13 43.43,27.18 38.1,27.18
  pour Top: 10.92,6.86 12.45,6.86 12.45,1.02 1.27,1.02 1.27,4.06 10.92,4.06
  pour Bottom: 6.1,7.62 8.13,7.62 8.13,5.33 12.7,5.33 12.7,0.76 6.1,0.76
VBUS  (via drill 0.35, 0.51)
  Top 0.152: 33.43,24.48 C15.1
  Top 0.254: IC1.8 30.72,9.66 v30.48,9.91 | v24.89,8.64 22.1,8.64 20.32,6.86 20.32,5.63 J6.VBUS
  Top 0.305: U4.4 33.53,24.57 | C15.1 LED2.A 33.27,26.3 v32.26,25.29
  Top 0.406: 33.53,24.57 33.43,24.48
  Route3 0.508: v30.48,9.91 30.48,23.51 v32.26,25.29
  Bottom 0.254: v24.89,8.64 24.89,9.14 25.65,9.91 v30.48,9.91

### Text on the board
tPlace: HFS 4011s | Rev 0